# EAGLE design ciborg-3 (EAGLE 5.11)
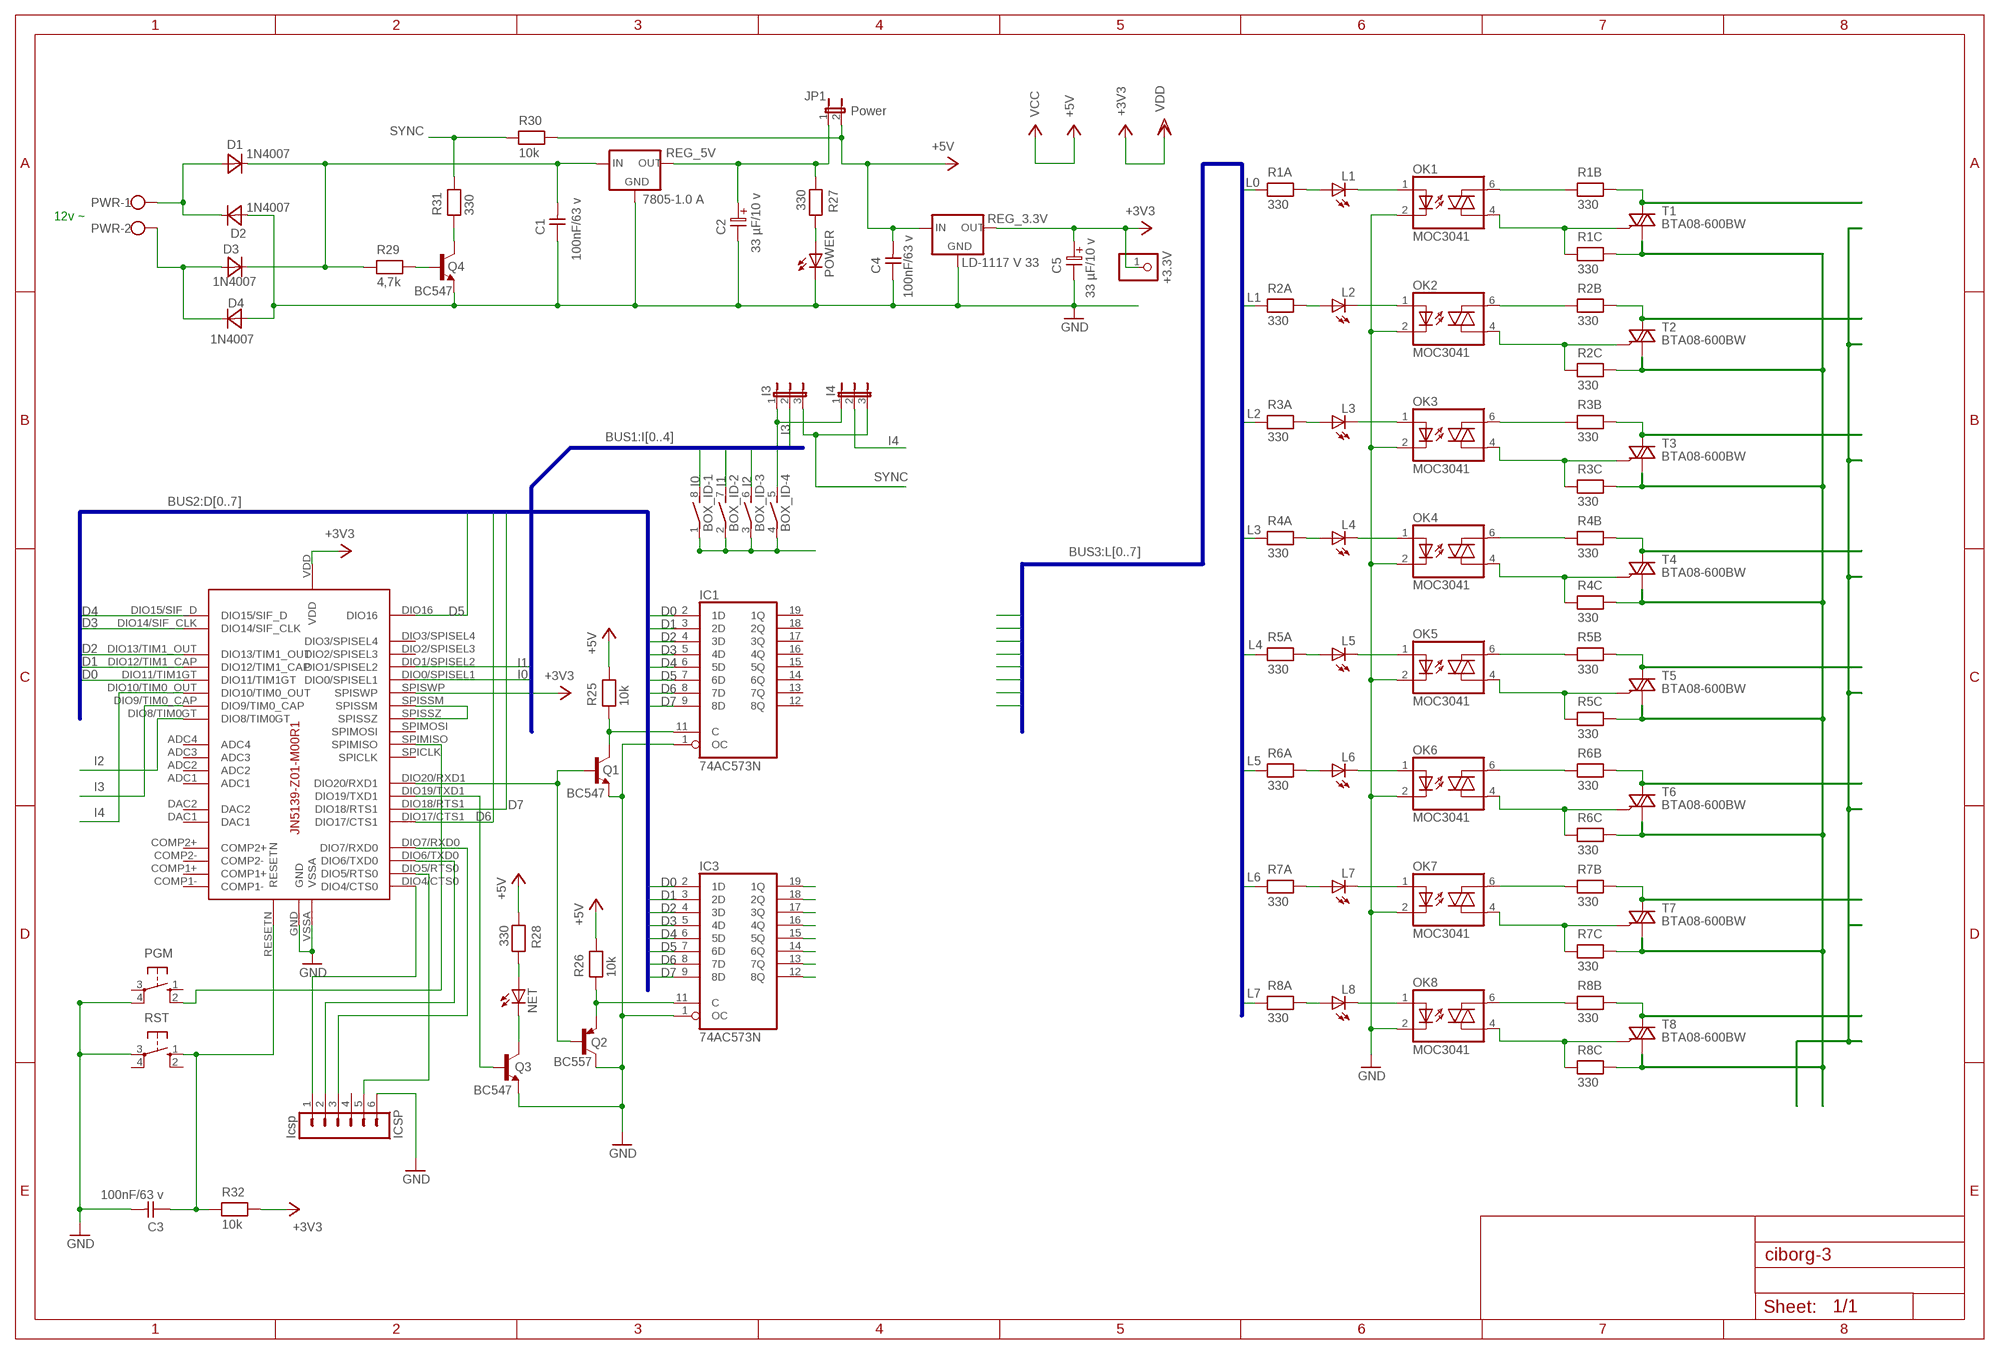
[diagram p0: schematic, sheet 1]

## Parts
+3.3V  PINHD-1X1  [1X01]
BOX_ID  DIP04S  [DIP04S]
C1  100nF/63 v  CAPNP-5  [C-5]
C2  33 µF/10 v  ELC-2,5L  [ES-2,5L]
C3  100nF/63 v  CAPNP-5  [C-5]
C4  100nF/63 v  CAPNP-5  [C-5]
C5  33 µF/10 v  ELC-2,5L  [ES-2,5L]
D1  1N4007  DIODE-10  [D-10]
D2  1N4007  DIODE-10  [D-10]
D3  1N4007  DIODE-10  [D-10]
D4  1N4007  DIODE-10  [D-10]
I3  JP2E  [JP2]
I4  JP2E  [JP2]
IC1  74AC573N  [DIL20]
IC3  74AC573N  [DIL20]
ICSP  Icsp  MA06-1  [MA06-1]
JP1  Power  JP1E  [JP1]
L1  LED3MM  [LED3MM]
L2  LED3MM  [LED3MM]
L3  LED3MM  [LED3MM]
L4  LED3MM  [LED3MM]
L5  LED3MM  [LED3MM]
L6  LED3MM  [LED3MM]
L7  LED3MM  [LED3MM]
L8  LED3MM  [LED3MM]
NET  LED3MM  [LED3MM]
OK1  MOC3041  IL420  [DIL06]
OK2  MOC3041  IL420  [DIL06]
OK3  MOC3041  IL420  [DIL06]
OK4  MOC3041  IL420  [DIL06]
OK5  MOC3041  IL420  [DIL06]
OK6  MOC3041  IL420  [DIL06]
OK7  MOC3041  IL420  [DIL06]
OK8  MOC3041  IL420  [DIL06]
PGM  10-XX  [B3F-10XX]
POWER  LED3MM  [LED3MM]
PWR  AK550/2  [AK550/2]
Q1  BC547  [TO92]
Q2  BC557  [TO92]
Q3  BC547  [TO92]
Q4  BC547  [TO92]
R1A  330  RESEU-7,5  [R-7,5]
R1B  330  RESEU-7,5  [R-7,5]
R1C  330  RESEU-7,5  [R-7,5]
R2A  330  RESEU-7,5  [R-7,5]
R2B  330  RESEU-7,5  [R-7,5]
R2C  330  RESEU-7,5  [R-7,5]
R3A  330  RESEU-7,5  [R-7,5]
R3B  330  RESEU-7,5  [R-7,5]
R3C  330  RESEU-7,5  [R-7,5]
R4A  330  RESEU-7,5  [R-7,5]
R4B  330  RESEU-7,5  [R-7,5]
R4C  330  RESEU-7,5  [R-7,5]
R5A  330  RESEU-7,5  [R-7,5]
R5B  330  RESEU-7,5  [R-7,5]
R5C  330  RESEU-7,5  [R-7,5]
R6A  330  RESEU-7,5  [R-7,5]
R6B  330  RESEU-7,5  [R-7,5]
R6C  330  RESEU-7,5  [R-7,5]
R7A  330  RESEU-7,5  [R-7,5]
R7B  330  RESEU-7,5  [R-7,5]
R7C  330  RESEU-7,5  [R-7,5]
R8A  330  RESEU-7,5  [R-7,5]
R8B  330  RESEU-7,5  [R-7,5]
R8C  330  RESEU-7,5  [R-7,5]
R25  10k  RESEU-7,5  [R-7,5]
R26  10k  RESEU-7,5  [R-7,5]
R27  330  RESEU-7,5  [R-7,5]
R28  330  RESEU-7,5  [R-7,5]
R29  4,7k  RESEU-7,5  [R-7,5]
R30  10k  RESEU-7,5  [R-7,5]
R31  330  RESEU-7,5  [R-7,5]
R32  10k  RESEU-7,5  [R-7,5]
REG_3.3V  LD-1117 V 33  78XXS  [78XXS]
REG_5V  7805-1.0 A  78XXS  [78XXS]
RST  10-XX  [B3F-10XX]
T1  BTA08-600BW  TIC225S  [TO220DS]
T2  BTA08-600BW  TIC225S  [TO220DS]
T3  BTA08-600BW  TIC225S  [TO220DS]
T4  BTA08-600BW  TIC225S  [TO220DS]
T5  BTA08-600BW  TIC225S  [TO220DS]
T6  BTA08-600BW  TIC225S  [TO220DS]
T7  BTA08-600BW  TIC225S  [TO220DS]
T8  BTA08-600BW  TIC225S  [TO220DS]
U1  JN5139-Z01-M00R1  [JENNIC5139MODULE]

## Nets
D0: IC1.2(1D) IC3.2(1D) U1.DIO11/TIM1GT
D1: IC1.3(2D) IC3.3(2D) U1.DIO12/TIM1_CAP
D2: IC1.4(3D) IC3.4(3D) U1.DIO13/TIM1_OUT
D3: IC1.5(4D) IC3.5(4D) U1.DIO14/SIF_CLK
D4: IC1.6(5D) IC3.6(5D) U1.DIO15/SIF_D
D5: IC1.7(6D) IC3.7(6D) U1.DIO16
D6: IC1.8(7D) IC3.8(7D) U1.DIO17/CTS1
D7: IC1.9(8D) IC3.9(8D) U1.DIO18/RTS1
GND: C1.1 C2.2 C3.2 C4.1 C5.2 D2.1(A) D4.1(A) IC1.1(OC) IC3.1(OC) ICSP.6 OK1.2(C) OK2.2(C) OK3.2(C) OK4.2(C) OK5.2(C) OK6.2(C) OK7.2(C) OK8.2(C) PGM.4(P1) POWER.K(C) Q1.1(E) Q2.3(C) Q3.1(E) Q4.1(E) REG_3.3V.GND REG_5V.GND RST.3(P) U1.GND U1.VSSA
I0: BOX_ID.8 U1.DIO0/SPISEL1
I1: BOX_ID.7 U1.DIO1/SPISEL2
I2: BOX_ID.6 U1.DIO8/TIM0GT
I3: I3.2 U1.DIO9/TIM0_CAP
I4: I4.2 U1.DIO10/TIM0_OUT
L0: R1A.1
L1: R2A.1
L2: R3A.1
L3: R4A.1
L4: R5A.1
L5: R6A.1
L6: R7A.1
L7: R8A.1
N$1: L4.K(C) OK4.1(A)
N$2: C2.1 JP1.1 R27.1 REG_5V.OUT
N$3: BOX_ID.1 BOX_ID.2 BOX_ID.3 BOX_ID.4
N$6: OK2.4(A1) R2C.1 T2.G
N$7: C3.1 R32.1 RST.1(S) U1.RESETN
N$8: OK1.4(A1) R1C.1 T1.G
N$10: OK3.4(A1) R3C.1 T3.G
N$12: OK4.4(A1) R4C.1 T4.G
N$13: L1.K(C) OK1.1(A)
N$15: OK5.4(A1) R5C.1 T5.G
N$17: L2.K(C) OK2.1(A)
N$18: OK6.4(A1) R6C.1 T6.G
N$19: L3.K(C) OK3.1(A)
N$21: OK7.4(A1) R7C.1 T7.G
N$22: L5.K(C) OK5.1(A)
N$24: OK8.4(A1) R8C.1 T8.G
N$25: OK1.6(A2) R1B.1
N$26: OK2.6(A2) R2B.1
N$27: L6.K(C) OK6.1(A)
N$29: C1.2 D1.2(K) D3.2(K) R29.1 REG_5V.IN
N$30: OK3.6(A2) R3B.1
N$31: OK4.6(A2) R4B.1
N$32: L7.K(C) OK7.1(A)
N$33: OK5.6(A2) R5B.1
N$34: OK6.6(A2) R6B.1
N$35: OK7.6(A2) R7B.1
N$36: OK8.6(A2) R8B.1
N$37: L8.K(C) OK8.1(A)
N$38: NET.K(C) Q3.3(C)
N$45: IC3.19(1Q)
N$46: IC3.18(2Q)
N$47: IC3.17(3Q)
N$48: IC3.16(4Q)
N$49: IC3.15(5Q)
N$50: IC3.14(6Q)
N$51: IC3.13(7Q)
N$52: IC3.12(8Q)
N$53: L2.A R2A.2
N$54: L3.A R3A.2
N$55: L4.A R4A.2
N$56: L5.A R5A.2
N$57: L6.A R6A.2
N$58: L7.A R7A.2
N$59: L8.A R8A.2
N$60: L1.A R1A.2
N$61: IC1.11(C) Q1.3(C) R25.1
N$62: NET.A R28.2
N$63: IC3.11(C) Q2.1(E) R26.1
N$64: Q1.2(B) Q2.2(B) U1.DIO20/RXD1
N$65: POWER.A R27.2
N$66: BOX_ID.5 I3.1 I4.1
N$67: ICSP.2 U1.DIO6/TXD0
N$68: D1.1(A) D2.2(K) PWR.1
N$69: D3.1(A) D4.2(K) PWR.2
N$70: PGM.2(S1) U1.SPIMISO
N$71: Q4.2(B) R29.2
N$72: Q4.3(C) R31.1
N$73: ICSP.1 U1.DIO4/CTS0
N$74: ICSP.5 U1.DIO5/RTS0
N$75: Q3.2(B) U1.DIO19/TXD1
N$76: U1.SPISSM U1.SPISSZ
N$77: ICSP.3 U1.DIO7/RXD0
N$78 [AC_VOLTAGE]: R1B.2 T1.A2
N$79 [AC_VOLTAGE]: R2B.2 T2.A2
N$80 [AC_VOLTAGE]: R3B.2 T3.A2
N$81 [AC_VOLTAGE]: R4B.2 T4.A2
N$82 [AC_VOLTAGE]: R5B.2 T5.A2
N$83 [AC_VOLTAGE]: R6B.2 T6.A2
N$84 [AC_VOLTAGE]: R7B.2 T7.A2
NEUTRE [AC_VOLTAGE]: R1C.2 R2C.2 R3C.2 R4C.2 R5C.2 R6C.2 R7C.2 R8C.2 T1.A1 T2.A1 T3.A1 T4.A1 T5.A1 T6.A1 T7.A1 T8.A1
PHASE [AC_VOLTAGE]: R8B.2 T8.A2
SYNC: I3.3 I4.3 R30.1 R31.2
VCC: C4.2 JP1.2 R25.2 R26.2 R28.1 R30.2 REG_3.3V.IN ; supply symbol labelled +5V
VDD: +3.3V.1 C5.1 R32.2 REG_3.3V.OUT U1.SPISWP U1.VDD ; supply symbol labelled +3V3
Unconnected: IC1.12(8Q) IC1.13(7Q) IC1.14(6Q) IC1.15(5Q) IC1.16(4Q) IC1.17(3Q) IC1.18(2Q) IC1.19(1Q) ICSP.4 PGM.1(S) PGM.3(P) RST.2(S1) RST.4(P1) U1.ADC1 U1.ADC2 U1.ADC3 U1.ADC4 U1.COMP1+ U1.COMP1- U1.COMP2+ U1.COMP2- U1.DAC1 U1.DAC2 U1.DIO2/SPISEL3 U1.DIO3/SPISEL4 U1.SPICLK U1.SPIMOSI

## Buses
BUS3:L[0..7]
BUS2:D[0..7]
BUS1:I[0..4]

## Notes on the sheet
- 12v ~

## Power pins joined to a net without a drawn wire
GND: IC1.10(GND) IC3.10(GND)
VCC: IC1.20(VCC) IC3.20(VCC)

## Library data of the parts
+3.3V = pinhead:PINHD-1X1: PIN HEADER
BOX_ID = switch-dil:DIP04S: DIL/CODE SWITCH; OC_FARNELL: unknown; OC_NEWARK: unknown
C1 C3 C4 = discrete:CAPNP-5
C2 C5 = discrete:ELC-2,5L
D1-D4 = discrete:DIODE-10
I3 I4 = jumper:JP2E: JUMPER
IC1 IC3 = 74xx-eu:74*573: 8-bit D latch BUS DRIVER
ICSP = con-lstb:MA06-1: PIN HEADER; OC_FARNELL: unknown; OC_NEWARK: unknown
JP1 = jumper:JP1E: JUMPER
L1-L8 NET POWER = led:LED: LED OSRAM: - CHIPLED LG R971, LG N971, LY N971, LG Q971, LY Q971, LO R971, LY R971 LH N974, LH R974 LS Q976, LO Q976, LY Q976 LO Q996 - Hyper CHIPLED LW Q18S LB Q993, LB Q99A, LB R99A - SideLED LS A670, LO A670, LY A670, LG A670, LP A670 LB A673, LV A673, LT A673, LW A673 LH A674 LY A675 LS A676, LA A676, LO A676, LY A676, LW A676 LS A679, LY A679, LG A679 - Hyper Micro SIDELED® LS Y876, LA Y876, LO Y876, LY Y876 LT Y87S - SmartLED LW L88C, LW L88S LB L89C, LB L89S, LG L890 LS L89K, LO L89K, LY L89K LS L896, LA L896, LO L896, LY L896 - TOPLED LS T670, LO T670, LY T670, LG T670, LP T670 LSG T670, LSP T670, LSY T670, LOP T670, LYG T670 LG T671, LOG T671, LSG T671 LB T673, LV T673, LT T673, LW T673 LH T674 LS T676, LA T676, LO T676, LY T676, LB T676, LH T676, LSB T676, LW T676 LB T67C, LV T67C, LT T67C, LS T67K, LO T67K, LY T67K, LW E67C LS E67B, LA E67B, LO E67B, LY E67B, LB E67C, LV E67C, LT E67C LW T67C LS T679, LY T679, LG T679 LS T770, LO T770, LY T770, LG T770, LP T770 LB T773, LV T773, LT T773, LW T773 LH T774 LS E675, LA E675, LY E675, LS T675 LS T776, LA T776, LO T776, LY T776, LB T776 LHGB T686 LT T68C, LB T68C - Hyper Mini TOPLED® LB M676 - Mini TOPLED Santana® LG M470 LS M47K, LO M47K, LY M47K Source: http://www.osram.convergy.de LUXEON: - LUMILED® LXK2-PW12-R00, LXK2-PW12-S00, LXK2-PW14-U00, LXK2-PW14-V00 LXK2-PM12-R00, LXK2-PM12-S00, LXK2-PM14-U00 LXK2-PE12-Q00, LXK2-PE12-R00, LXK2-PE12-S00, LXK2-PE14-T00, LXK2-PE14-U00 LXK2-PB12-K00, LXK2-PB12-L00, LXK2-PB12-M00, LXK2-PB14-N00, LXK2-PB14-P00, LXK2-PB14-Q00 LXK2-PR12-L00, LXK2-PR12-M00, LXK2-PR14-Q00, LXK2-PR14-R00 LXK2-PD12-Q00, LXK2-PD12-R00, LXK2-PD12-S00 LXK2-PH12-R00, LXK2-PH12-S00 LXK2-PL12-P00, LXK2-PL12-Q00, LXK2-PL12-R00 Source: www.luxeon.com KINGBRIGHT: KA-3528ASYC Source: www.kingbright.com
OK1-OK8 = optocoupler:IL420: SIEMENS OPTO COUPLER
PGM RST = switch-omron:10-XX: OMRON SWITCH; MPN: B3F-1000; OC_FARNELL: 176432; OC_NEWARK: 36M3542
PWR = con-ptr500+:AK550/2: CONNECTOR
Q1 Q3 Q4 = transistor:BC547: NPN TRANSISTOR
Q2 = transistor-pnp:BC557: PNP Transistor
R1A R1B R1C R2A R2B R2C R3A R3B R3C R4A R4B R4C R5A R5B R5C R6A R6B R6C R7A R7B R7C R8A R8B R8C R25-R32 = discrete:RESEU-7,5
REG_3.3V REG_5V = v-reg:78XXS: VOLTAGE REGULATOR
T1-T8 = triac:TIC225S: TRIAC
U1 = jennic:JN5139-Z01-M00R1: Jennic 5139 Zigbee Module

## Net classes
0 default: width 0.254 mm, clearance 0.254 mm
1 AC_VOLTAGE: width 1.5 mm, clearance 0.254 mm
2 AC_TERRE: width 1.422 mm, clearance 0.254 mm

## Board
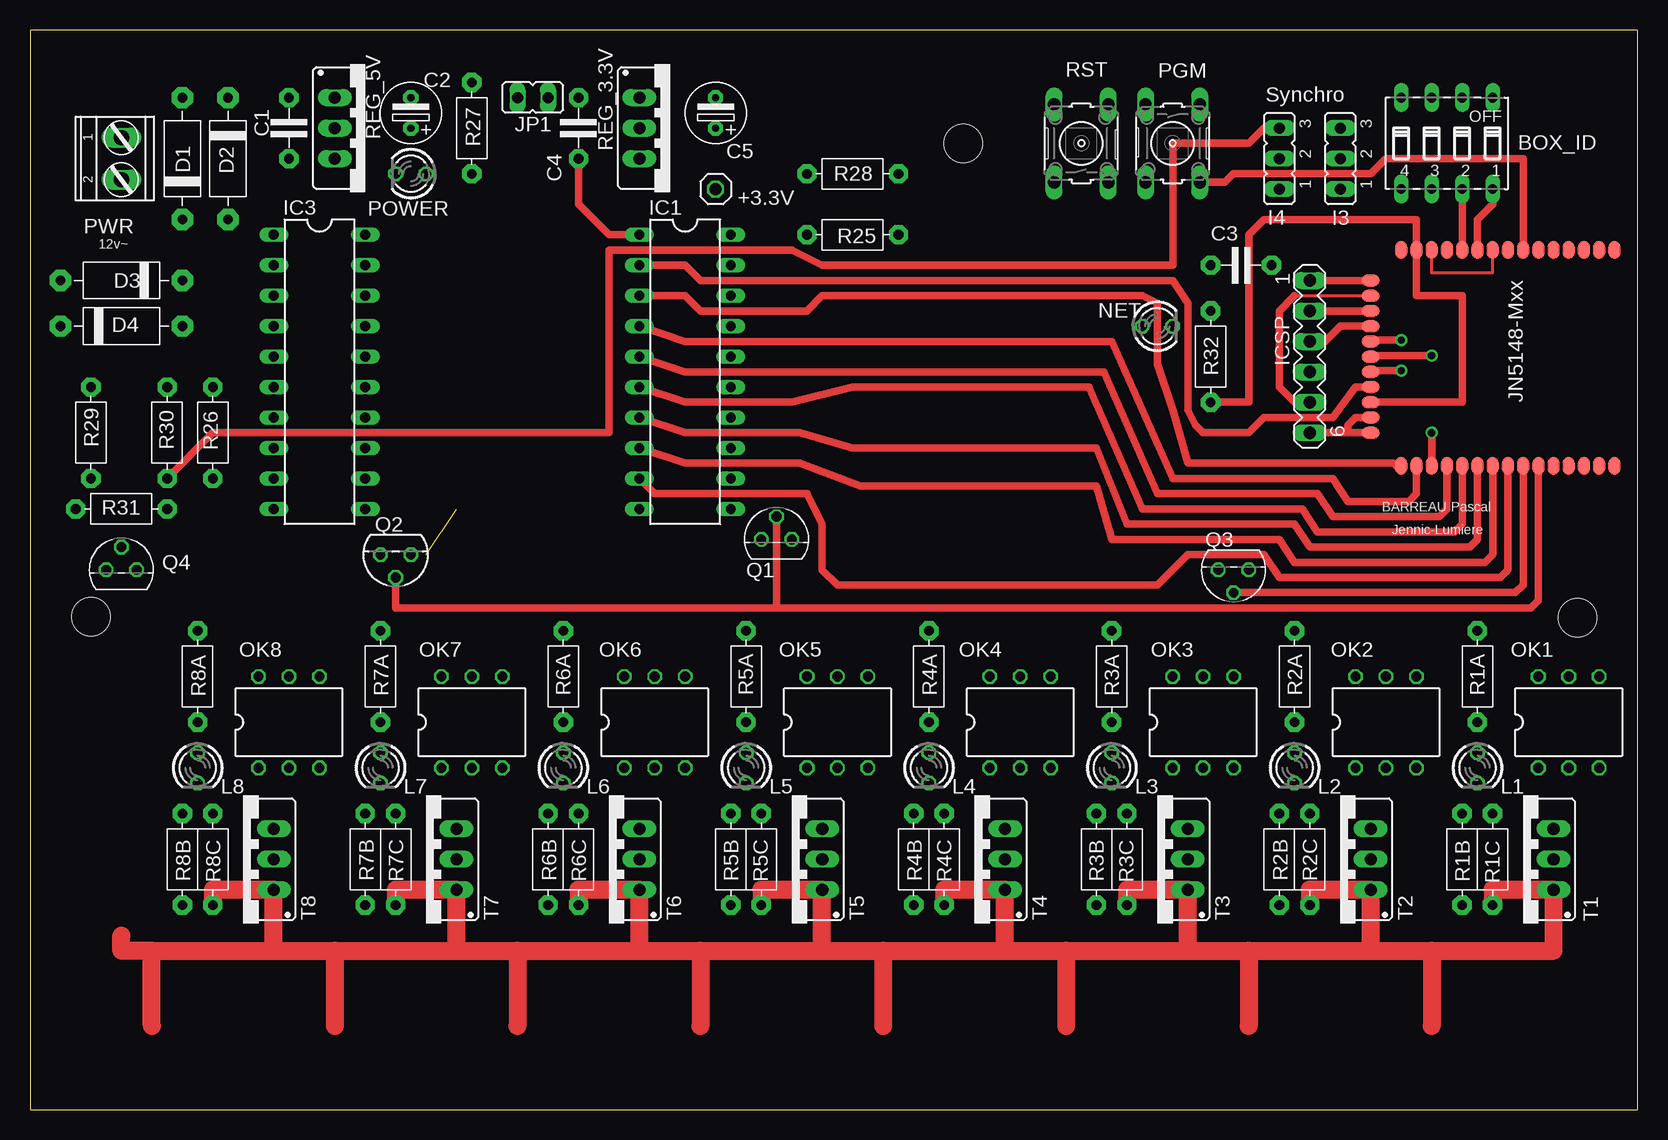
[diagram p1: board, top side]
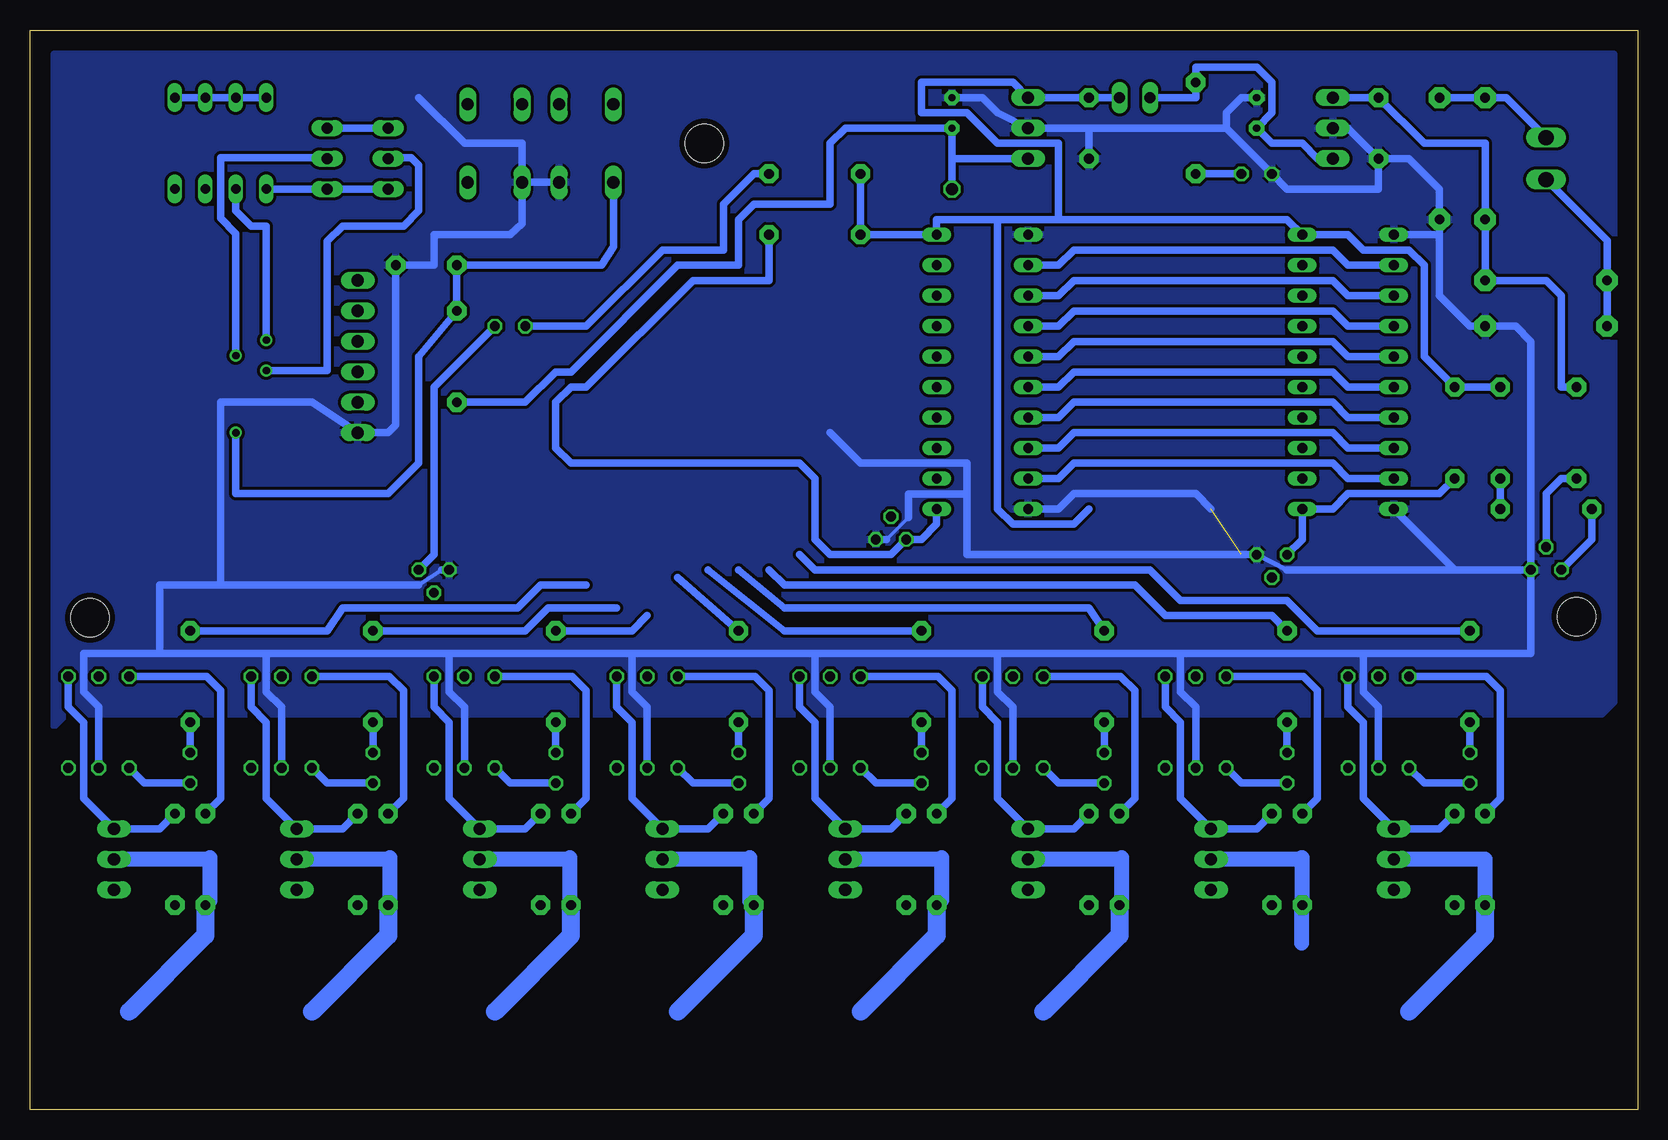
[diagram p2: board, bottom side, seen from below]

Size 134 x 90 mm. Coordinates in mm from the lower left corner, seen from the top.
Outline: 0,0 134,0 134,90 0,90 0,0
Copper layers (1*16): Top 0.018mm / dielectric 1.55mm / Bottom 0.018mm
Design rules "eC-PCB_proto-2-layer": minimum track width 0.15mm, minimum drill 0.25mm, track to track 0.15mm, track to pad 0.15mm, pad to pad 0.15mm, via to via 0.15mm, smd to smd 0.15mm, copper to edge 0.45mm, drill to drill 0.3mm, minimum pad ring 0.2mm, minimum via ring 0.2mm, stop-mask expansion 0.1mm, vias tented up to drill 0mil, thermal gap 0.2mm
Holes 3.2 mm at 129,41 77.8,80.55 5.08,41.1

### Footprints (pad centres in the part's own frame; a part is rotated, then mirrored left to right if it is on the bottom)
1X01 = drill 1.016 octagon: 1 0,0
DIP04S = drill 0.813 long: 1 -3.81,-3.81; 2 -1.27,-3.81; 3 1.27,-3.81; 4 3.81,-3.81; 5 3.81,3.81; 6 1.27,3.81; 7 -1.27,3.81; 8 -3.81,3.81
C-5 = drill 0.813 pad 1.6 octagon: 1 -2.54,0; 2 2.54,0
ES-2,5L = drill 0.61 pad 1.27 octagon: 1 0,0; 2 2.54,0
D-10 = drill 0.813 pad 1.778 octagon: 1 -5.08,0; 2 5.08,0
JP2 = drill 0.914 long: 1 -2.54,0; 2 0,0; 3 2.54,0
DIL20 = drill 0.813 long: 1 -11.43,-3.81; 2 -8.89,-3.81; 3 -6.35,-3.81; 4 -3.81,-3.81; 5 -1.27,-3.81; 6 1.27,-3.81; 7 3.81,-3.81; 8 6.35,-3.81; 9 8.89,-3.81; 10 11.43,-3.81; 11 11.43,3.81; 12 8.89,3.81; 13 6.35,3.81; 14 3.81,3.81; 15 1.27,3.81; 16 -1.27,3.81; 17 -3.81,3.81; 18 -6.35,3.81; 19 -8.89,3.81; 20 -11.43,3.81
MA06-1 = drill 1.016 long: 1 -6.35,0; 2 -3.81,0; 3 -1.27,0; 4 1.27,0; 5 3.81,0; 6 6.35,0
JP1 = drill 0.914 long: 1 0,-1.27; 2 0,1.27
LED3MM = drill 0.813 octagon: A -1.27,0; K 1.27,0
DIL06 = drill 0.813 octagon: 1 -2.54,-3.81; 2 0,-3.81; 3 2.54,-3.81; 4 2.54,3.81; 5 0,3.81; 6 -2.54,3.81
B3F-10XX = drill 1.016 long: 1 -3.251,2.261; 2 3.251,2.261; 3 -3.251,-2.261; 4 3.251,-2.261
AK550/2 = drill 1.27 long: 1 -1.75,0; 2 1.75,0
TO92 = drill 0.813 octagon: 1 1.27,0; 2 0,1.905; 3 -1.27,0
R-7,5 = drill 0.813 pad 1.6 octagon: 1 -3.81,0; 2 3.81,0
78XXS = drill 1.016 long: GND 0,-2.54; IN -2.54,-2.54; OUT 2.54,-2.54
TO220DS = drill 1.016 long: A1 -2.54,-2.54; A2 0,-2.54; G 2.54,-2.54
JENNIC5139MODULE = smd 1.5 x 1: ADC1 18,17.78; ADC2 18,19.05; ADC3 18,20.32; ADC4 0,20.32; COMP1+ 18,16.51; COMP1- 18,15.24; COMP2+ 0,16.51; COMP2- 0,15.24; DAC1 0,19.05; DAC2 0,17.78; DIO0/SPISEL1 0,8.89; DIO1/SPISEL2 0,7.62; DIO2/SPISEL3 0,6.35; DIO3/SPISEL4 0,2.54; DIO12/TIM1_CAP 18,2.54; DIO13/TIM1_OUT 18,3.81; DIO14/SIF_CLK 18,6.35; DIO15/SIF_D 18,7.62; DIO16 18,8.89; DIO17/CTS1 18,10.16; DIO18/RTS1 18,11.43; DIO19/TXD1 18,12.7; DIO20/RXD1 18,13.97; RESETN 18,5.08; SPICLK 0,13.97; SPIMISO 0,12.7; SPIMOSI 0,11.43; SPISSM 0,5.08; SPISSZ 0,10.16; SPISWP 0,3.81 | smd 1 x 1.5: DIO4/CTS0 2.54,0; DIO5/RTS0 3.81,0; DIO6/TXD0 5.08,0; DIO7/RXD0 6.35,0; DIO8/TIM0GT 7.62,0; DIO9/TIM0_CAP 8.89,0; DIO10/TIM0_OUT 10.16,0; DIO11/TIM1GT 11.43,0; GND 13.97,0; VDD 12.7,0; VSSA 15.24,0

### Placement (x,y rotation side)
+3.3V  57.15,76.74 0 top
BOX_ID  118.11,80.55 180 top
C1  21.59,81.82 90 top
C2  31.75,81.82 90 top
C3  100.97,70.39 0 top
C4  45.72,81.82 90 top
C5  57.15,81.82 90 top
D1  12.7,79.28 270 top
D2  16.51,79.28 90 top
D3  7.62,69.12 0 top
D4  7.62,65.31 180 top
I3  109.22,79.28 90 top
I4  104.14,79.28 90 top
IC1  54.61,61.5 270 top
IC3  24.13,61.5 270 top
ICSP  106.68,62.77 270 top
JP1  41.91,84.36 270 top
L1  120.65,28.48 270 top
L2  105.41,28.48 270 top
L3  90.17,28.48 270 top
L4  74.93,28.48 270 top
L5  59.69,28.48 270 top
L6  44.45,28.48 270 top
L7  29.21,28.48 270 top
L8  13.97,28.48 270 top
NET  93.98,65.31 0 top
OK1  128.27,32.29 0 top
OK2  113.03,32.29 0 top
OK3  97.79,32.29 0 top
OK4  82.55,32.29 0 top
OK5  67.31,32.29 0 top
OK6  52.07,32.29 0 top
OK7  36.83,32.29 0 top
OK8  21.59,32.29 0 top
PGM  95.25,80.55 270 top
POWER  31.75,78.01 180 top
PWR  7.62,79.28 270 top
Q1  62.23,47.53 0 top
Q2  30.48,46.26 180 top
Q3  100.33,44.99 180 top
Q4  7.62,44.99 0 top
R1A  120.65,36.1 270 top
R1B  119.38,20.86 270 top
R1C  121.92,20.86 270 top
R2A  105.41,36.1 270 top
R2B  104.14,20.86 270 top
R2C  106.68,20.86 270 top
R3A  90.17,36.1 270 top
R3B  88.9,20.86 270 top
R3C  91.44,20.86 270 top
R4A  74.93,36.1 270 top
R4B  73.66,20.86 270 top
R4C  76.2,20.86 270 top
R5A  59.69,36.1 270 top
R5B  58.42,20.86 270 top
R5C  60.96,20.86 270 top
R6A  44.45,36.1 270 top
R6B  43.18,20.86 270 top
R6C  45.72,20.86 270 top
R7A  29.21,36.1 270 top
R7B  27.94,20.86 270 top
R7C  30.48,20.86 270 top
R8A  13.97,36.1 270 top
R8B  12.7,20.86 270 top
R8C  15.24,20.86 270 top
R25  68.58,72.93 180 top
R26  15.24,56.42 90 top
R27  36.83,81.82 270 top
R28  68.58,78.01 0 top
R29  5.08,56.42 270 top
R30  11.43,56.42 90 top
R31  7.62,50.07 0 top
R32  98.42,62.77 270 top
REG_3.3V  53.34,81.82 270 top
REG_5V  27.94,81.82 270 top
RST  87.63,80.55 90 top
T1  124.46,20.86 90 top
T2  109.22,20.86 90 top
T3  93.98,20.86 90 top
T4  78.74,20.86 90 top
T5  63.5,20.86 90 top
T6  48.26,20.86 90 top
T7  33.02,20.86 90 top
T8  17.78,20.86 90 top
U1  111.76,71.66 270 top

### Tracks (layer width: path | path; a pad name or v marks a point on that pad's centre or on a via)
D0
  Top 0.61: IC1.2 54.61,70.39 55.88,69.12 95.25,69.12 96.52,67.22 96.52,58.33 97.16,57.05 97.79,56.42 101.6,56.42 102.87,57.69 108.58,57.69 110.49,60.23 U1.DIO11/TIM1GT
  Bottom 0.61: IC3.2 24.13,70.39 25.4,71.66 46.99,71.66 48.26,70.39 IC1.2
D1
  Top 0.61: IC1.3 54.61,67.85 55.88,66.58 64.77,66.58 66.04,67.85 92.71,67.85 93.98,67.22 93.98,62.13 95.25,58.33 96.52,53.88 113.67,53.88 113.89,53.66 U1.DIO12/TIM1_CAP
  Bottom 0.61: IC3.3 24.13,67.85 25.4,69.12 46.99,69.12 48.26,67.85 IC1.3
D2
  Top 0.254: U1.DIO13/TIM1_OUT 115.57,53.88
  Top 0.61: IC1.4 54.61,64.04 90.17,64.04 95.25,52.61 108.58,52.61 109.86,50.7 114.94,50.7 115.57,51.34 U1.DIO13/TIM1_OUT
  Bottom 0.61: IC3.4 24.13,65.31 25.4,66.58 46.99,66.58 48.26,65.31 IC1.4
D3
  Top 0.61: IC1.5 54.61,61.5 89.53,61.5 93.98,51.34 107.31,51.34 108.58,49.44 117.47,49.44 118.11,50.07 U1.DIO14/SIF_CLK
  Bottom 0.61: IC3.5 24.13,62.77 25.4,64.04 46.99,64.04 48.26,62.77 IC1.5
D4
  Top 0.61: IC1.6 54.61,58.96 63.5,58.96 68.58,60.23 88.27,60.23 92.71,50.07 106.05,50.07 107.31,48.16 118.75,48.16 119.38,48.8 U1.DIO15/SIF_D
  Bottom 0.61: IC3.6 24.13,60.23 25.4,61.5 46.99,61.5 48.26,60.23 IC1.6
D5
  Top 0.61: IC1.7 54.61,56.42 64.14,56.42 68.58,55.15 88.9,55.15 91.44,48.8 105.41,48.8 106.68,46.9 120.02,46.9 120.65,47.53 U1.DIO16
  Bottom 0.61: IC3.7 24.13,57.69 25.4,58.96 46.99,58.96 48.26,57.69 IC1.7
D6
  Top 0.61: IC1.8 54.61,53.88 64.14,53.88 69.22,51.98 88.9,51.98 90.17,47.53 104.14,47.53 105.41,45.62 121.28,45.62 121.92,46.26 U1.DIO17/CTS1
  Bottom 0.61: IC3.8 24.13,55.15 25.4,56.42 46.99,56.42 48.26,55.15 IC1.8
D7
  Top 0.254: U1.DIO18/RTS1 123.19,53.88
  Top 0.61: U1.DIO18/RTS1 123.19,44.99 122.56,44.35 104.14,44.35 102.87,46.26 96.52,46.26 93.98,43.72 67.31,43.72 66.04,44.99 66.04,48.8 64.77,51.34 52.07,51.34 IC1.9
  Bottom 0.61: IC3.9 24.13,52.61 25.4,53.88 46.99,53.88 48.26,52.61 IC1.9
GND  (1 unrouted)
  Top 0.61: ICSP.6 109.86,56.42 | 109.86,56.42 U1.VSSA | C4.1 45.72,75.47 48.26,72.93 IC1.1 | U1.GND 110.49,57.69 109.86,57.05 109.86,56.42
  Bottom 0.305: 60.76,49.37 62.6,47.53 | 55.91,51.31 55.88,51.34 | 101.6,43.72 99.69,44.99
  Bottom 0.406: 29.21,44.99 Q2.3
  Bottom 0.61: REG_3.3V.GND 49.53,81.82 | REG_3.3V.GND 53.34,83.09 54.61,84.36 C5.2 | C1.1 24.13,81.82 REG_5V.GND | C1.1 19.05,79.28 16.51,76.74 D2.1 16.51,72.93 | C2.2 33.02,84.36 34.29,83.09 34.29,81.82 | 34.29,81.82 POWER.K 29.21,76.74 21.59,76.74 C1.1 | 34.29,81.82 45.72,81.82 | 45.72,81.82 REG_3.3V.GND | 45.72,81.82 C4.1 | IC1.10 48.26,50.07 46.99,51.34 36.83,51.34 35.56,50.07 | 16.51,72.93 16.51,67.85 13.97,65.31 D4.1 10.16,65.31 8.89,64.04 Q4.1 | 16.51,72.93 IC3.1 | 15.24,44.99 IC3.10 | Q4.1 15.24,44.99 | 15.24,44.99 29.21,44.99 | Q2.3 33.02,46.26 44.45,46.26 55.88,46.26 55.88,51.29 55.91,51.31 60.76,51.31 60.76,49.37 | 55.88,51.34 55.88,53.88 64.77,53.88 67.31,56.42 | 62.6,47.53 Q1.1 | PGM.4 RST.3 | PGM.4 92.99,73.84 93.98,72.93 100.33,72.93 100.33,70.39 C3.2 103.5,57.05 104.14,56.42 ICSP.6 110.49,58.96 118.11,58.96 118.11,43.72 | 101.6,84.36 97.79,80.55 92.98,80.55 92.98,78.29 PGM.4 | 99.69,44.99 Q3.1 | 118.11,43.72 101.6,43.72 | OK8.2 21.59,33.56 22.86,34.83 22.86,38.01 | 114.3,38.01 114.3,34.83 113.03,33.56 OK2.2 | 118.11,43.72 123.19,43.72 123.19,38.01 | 114.3,38.01 123.19,38.01 | 22.86,38.01 38.1,38.01 | 38.1,38.01 53.34,38.01 | 53.34,38.01 68.58,38.01 | 68.58,38.01 83.82,38.01 | 83.82,38.01 99.06,38.01 | 99.06,38.01 114.3,38.01 | OK7.2 36.83,33.56 38.1,34.83 38.1,38.01 | OK6.2 52.07,33.56 53.34,34.83 53.34,38.01 | OK5.2 67.31,33.56 68.58,34.83 68.58,38.01 | OK4.2 82.55,33.56 83.82,34.83 83.82,38.01 | OK3.2 97.79,33.56 99.06,34.83 99.06,38.01 | OK1.2 128.27,33.56 129.54,34.83 129.54,38.01 123.19,38.01 | 22.86,38.01 8.89,38.01 Q4.1
  pour Bottom: 2,88 132,88 132,32 131,33 3,33 2,34
I0
  Top 0.61: U1.DIO0/SPISEL1 120.65,74.2 121.92,75.47 BOX_ID.8
I1
  Top 0.61: U1.DIO1/SPISEL2 BOX_ID.7
I2  (via drill 0.6)
  Top 0.61: U1.DIO8/TIM0GT 111.86,64.14 v114.3,64.14
  Bottom 0.61: BOX_ID.6 116.84,74.93 115.57,73.66 114.3,73.66 v114.3,64.14
I3  (via drill 0.6)
  Top 0.61: U1.DIO9/TIM0_CAP 111.86,62.87 v116.84,62.87
  Bottom 0.61: I3.2 109.31,79.38 118.11,79.38 118.11,74.3 116.84,73.03 v116.84,62.87
I4  (via drill 0.6)
  Top 0.61: U1.DIO10/TIM0_OUT 111.86,61.59 v114.3,61.59
  Bottom 0.61: I4.2 104.05,79.38 102.23,79.38 101.6,78.74 101.6,74.93 102.87,73.66 107.95,73.66 109.22,72.39 109.22,61.59 v114.3,61.59
L0
  Bottom 0.61: 87.63,43.72 91.44,43.72 93.34,41.81 107.95,41.81 109.22,39.91 R1A.1
L1
  Bottom 0.61: 85.09,41.81 90.81,41.81 92.71,39.91 R2A.1
L2
  Bottom 0.61: 82.55,41.18 83.82,39.91 R3A.1
L3
  Bottom 0.61: R4A.1 80.01,44.35
L4
  Bottom 0.61: 77.47,44.99 71.12,39.91 R5A.1
L5
  Bottom 0.61: 74.93,44.99 71.12,41.81 45.72,41.81 R6A.1
L6
  Bottom 0.61: R7A.1 30.48,41.18 39.37,41.18 41.91,43.72 71.12,43.72 72.39,44.99
L7
  Bottom 0.61: R8A.1 26.67,39.91 29.21,42.45 38.1,42.45 40.64,44.99 68.58,44.99 69.85,46.26
N$1
  Bottom 0.61: L4.K 78.74,27.21 OK4.1
N$2
  Bottom 0.61: REG_5V.OUT 26.67,79.28 27.94,80.55 30.48,80.55 C2.1 30.48,83.09 30.48,85.63 31.75,86.9 36.83,86.9 R27.1 36.83,84.36 JP1.1
N$3
  Bottom 0.61: BOX_ID.1 BOX_ID.2 BOX_ID.3 BOX_ID.4
N$6
  Bottom 0.61: R2C.1 107.95,23.4 T2.G 114.3,25.94 114.3,32.29 115.57,33.56 OK2.4
N$7  (via drill 0.6)
  Top 0.61: v116.84,56.42 U1.RESETN
  Bottom 0.61: RST.1 85.37,71.94 86.36,70.39 C3.1 R32.1 101.6,62.77 101.6,53.88 104.14,51.34 116.84,51.34 v116.84,56.42
N$8
  Bottom 0.61: R1C.1 123.19,23.4 T1.G 129.54,25.94 129.54,32.29 130.81,33.56 OK1.4
N$10
  Bottom 0.61: R3C.1 92.71,23.4 T3.G 99.06,25.94 99.06,32.29 100.33,33.56 OK3.4
N$12
  Bottom 0.61: R4C.1 77.47,23.4 T4.G 83.82,25.94 83.82,32.29 85.09,33.56 OK4.4
N$13
  Bottom 0.61: L1.K 124.46,27.21 OK1.1
N$15
  Bottom 0.61: R5C.1 62.23,23.4 T5.G 68.58,25.94 68.58,32.29 69.85,33.56 OK5.4
N$17
  Bottom 0.61: L2.K 109.22,27.21 OK2.1
N$18
  Bottom 0.61: R6C.1 46.99,23.4 T6.G 53.34,25.94 53.34,32.29 54.61,33.56 OK6.4
N$19
  Bottom 0.61: L3.K 93.98,27.21 OK3.1
N$21
  Bottom 0.61: R7C.1 31.75,23.4 T7.G 38.1,25.94 38.1,32.29 39.37,33.56 OK7.4
N$22
  Bottom 0.61: L5.K 63.5,27.21 OK5.1
N$24
  Bottom 0.61: R8C.1 16.51,23.4 T8.G 22.86,25.94 22.86,32.29 24.13,33.56 OK8.4
N$25
  Bottom 0.61: R1B.1 118.11,25.94 118.11,34.92 119.28,36.1 OK1.6
N$26
  Bottom 0.61: R2B.1 102.87,25.94 102.87,34.92 104.05,36.1 OK2.6
N$27
  Bottom 0.61: L6.K 48.26,27.21 OK6.1
N$29
  Bottom 0.61: REG_5V.IN C1.2 17.78,80.55 12.7,80.55 D1.2 D3.2 7.62,69.12 6.35,67.85 6.35,60.23 R29.1
N$30
  Bottom 0.61: R3B.1 87.63,25.94 87.63,34.92 88.81,36.1 OK3.6
N$31
  Bottom 0.61: R4B.1 72.39,25.94 72.39,34.92 73.56,36.1 OK4.6
N$32
  Bottom 0.61: L7.K 33.02,27.21 OK7.1
N$33
  Bottom 0.61: R5B.1 57.15,25.94 57.15,34.92 58.33,36.1 OK5.6
N$34
  Bottom 0.61: R6B.1 41.91,25.94 41.91,34.92 43.09,36.1 OK6.6
N$35
  Bottom 0.61: R7B.1 26.67,25.94 26.67,34.92 27.84,36.1 OK7.6
N$36
  Bottom 0.61: R8B.1 11.43,25.94 11.43,34.92 12.61,36.1 OK8.6
N$37
  Bottom 0.61: L8.K 17.78,27.21 OK8.1
N$38
  Bottom 0.61: NET.K 100.33,60.23 100.33,46.26 Q3.3
N$53
  Bottom 0.61: L2.A R2A.2
N$54
  Bottom 0.61: L3.A R3A.2
N$55
  Bottom 0.61: L4.A R4A.2
N$56
  Bottom 0.61: L5.A R5A.2
N$57
  Bottom 0.61: L6.A R6A.2
N$58
  Bottom 0.61: L7.A R7A.2
N$59
  Bottom 0.61: L8.A R8A.2
N$60
  Bottom 0.61: L1.A R1A.2
N$61
  Bottom 0.61: IC1.11 58.42,48.8 59.69,47.53 Q1.3 62.23,46.26 67.31,46.26 68.58,47.53 68.58,52.61 69.85,53.88 88.9,53.88 90.17,55.15 90.17,58.96 88.9,60.23 87.63,60.23 78.74,69.12 72.39,69.12 R25.1
N$62
  Bottom 0.61: R28.2 73.66,78.01 76.2,75.47 76.2,71.66 81.28,71.66 87.63,65.31 NET.A
N$63
  Bottom 0.61: Q2.1 27.94,47.53 IC3.11 25.4,50.07 24.13,51.34 16.51,51.34 R26.1
N$64
  Top 0.61: 125.73,53.88 U1.DIO20/RXD1 125.73,42.45 125.09,41.81 62.23,41.81 | 62.23,41.81 Q1.2 | Q2.2 30.48,41.81 62.23,41.81
N$65
  Bottom 0.61: POWER.A R27.2
N$66
  Bottom 0.61: I4.1 I3.1 BOX_ID.5
N$67
  Top 0.61: ICSP.2 U1.DIO6/TXD0
N$68
  Bottom 0.61: PWR.1 10.95,84.36 D1.1 D2.2
N$69
  Bottom 0.61: PWR.2 2.54,72.45 D3.1 D4.2
N$70
  Top 0.61: PGM.2 99.62,77.3 100.33,78.01 111.76,78.01 113.03,79.28 124.46,79.28 U1.SPIMISO
N$71
  Bottom 0.61: R29.2 6.35,52.61 7.62,51.34 Q4.2
N$72
  Bottom 0.61: R31.1 3.81,47.53 Q4.3
N$73
  Top 0.61: ICSP.1 U1.DIO4/CTS0
N$74
  Top 0.254: 105.41,67.85 U1.DIO5/RTS0 | 105.41,58.96 ICSP.5
  Top 0.61: 105.41,67.85 104.14,66.58 104.14,60.23 105.41,58.96
N$75
  Top 0.61: U1.DIO19/TXD1 124.46,43.72 123.83,43.09 Q3.2
N$76
  Top 0.254: U1.SPISSM 116.84,69.75 121.92,69.75 U1.SPISSZ
N$77
  Top 0.61: U1.DIO7/RXD0 109.22,65.31 107.95,64.04 ICSP.3
N$78
  Bottom 1.27: T1.A2 119.14,20.86 119,21 119,17.43 R1B.2
  Bottom 1.5: 125.73,8.16 119.38,14.51 R1B.2
N$79
  Bottom 1.27: T2.A2 104.14,20.86 104,21 104,17.19 R2B.2
  Bottom 1.5: 110.49,8.16 104.14,14.51 R2B.2
N$80
  Bottom 1.27: T3.A2 89.14,20.86 89,21 89,17.15 R3B.2
  Bottom 1.5: 95.25,8.16 88.9,14.51 R3B.2
N$81
  Bottom 1.27: T4.A2 74.14,20.86 74,21 74,17.39 R4B.2
  Bottom 1.5: 80.01,8.16 73.66,14.51 R4B.2
N$82
  Bottom 1.27: T5.A2 58.14,20.86 58,21 58,17.47 R5B.2
  Bottom 1.5: 64.77,8.16 58.42,14.51 R5B.2
N$83
  Bottom 1.27: T6.A2 43.14,20.86 43,21 43,17.23 R6B.2
  Bottom 1.5: 49.53,8.16 43.18,14.51 R6B.2
N$84
  Bottom 1.27: T7.A2 28,20.86 28,21 27.94,21 R7B.2 28,17.05 28,13.86
NEUTRE
  Top 1.5: 10.16,13.24 7.62,13.24 7.62,14.51 | 10.16,13.24 20.32,13.24 | 20.32,13.24 25.4,13.24 | 25.4,13.24 35.56,13.24 | 35.56,13.24 40.64,13.24 | 40.64,13.24 50.8,13.24 | 50.8,13.24 55.88,13.24 | 55.88,13.24 66.04,13.24 | 66.04,13.24 71.12,13.24 | 71.12,13.24 81.28,13.24 | 81.28,13.24 86.36,13.24 | 86.36,13.24 96.52,13.24 | 96.52,13.24 101.6,13.24 | 101.6,13.24 111.76,13.24 | 111.76,13.24 116.84,13.24 | 116.84,13.24 127,13.24 T1.A1 121.92,18.32 R1C.2 | 10.16,6.97 10.16,13.24 | 25.4,13.24 25.4,6.97 | 20.32,13.24 T8.A1 15.24,18.32 R8C.2 | 35.56,13.24 T7.A1 30.48,18.32 R7C.2 | 50.8,13.24 T6.A1 45.72,18.32 R6C.2 | 40.64,13.24 40.64,6.97 | 55.88,13.24 55.88,6.97 | 71.12,13.24 71.12,6.97 | 86.36,13.24 86.36,6.97 | 101.6,13.24 101.6,6.97 | 116.84,13.24 116.84,6.97 | 66.04,13.24 T5.A1 60.96,18.32 R5C.2 | 81.28,13.24 T4.A1 76.2,18.32 R4C.2 | 96.52,13.24 T3.A1 91.44,18.32 R3C.2 | 111.76,13.24 T2.A1 106.68,18.32 R2C.2
PHASE
  Bottom 1.27: T8.A2 12.7,20.86 R8B.2
  Bottom 1.5: 19.05,8.16 12.7,14.51 R8B.2
SYNC
  Top 0.61: R30.1 15.24,56.42 48.26,56.42 48.26,71.66 63.5,71.66 66.04,70.39 95.25,70.39 95.25,80.55 101.6,80.55 102.87,81.82 I4.3
  Bottom 0.61: I4.3 I3.3 | R31.2 R30.1
VCC
  Bottom 0.61: JP1.2 C4.2 REG_3.3V.IN 52.07,85.63 59.69,85.63 59.69,83.09 55.88,83.09 53.34,80.55 48.26,80.55 48.26,74.2 | 45.72,50.07 46.99,48.8 52.07,48.8 53.34,50.07 53.34,74.2 | 48.26,74.2 29.21,74.2 IC3.20 24.13,72.93 22.86,71.66 19.05,71.66 17.78,70.39 17.78,62.77 R26.2 R30.2 | 48.26,74.2 53.34,74.2 | 53.34,74.2 58.42,74.2 IC1.20 R25.2 R28.1
VDD
  Top 0.61: U1.VDD 119.38,58.96 119.38,67.85 115.57,67.85 U1.SPISWP 115.57,74.2 102.87,74.2 101.6,72.93 101.6,58.96 R32.2
  Bottom 0.61: R32.2 92.71,58.96 90.17,61.5 88.9,61.5 80.01,70.39 74.93,70.39 74.93,74.2 73.66,75.47 67.31,75.47 67.31,80.55 66.04,81.82 C5.1 57.15,79.28 | REG_3.3V.OUT 57.15,79.28 | +3.3V.1 57.15,79.28

### Text on the board
tPlace: Synchro | 12v~ | BARREAU Pascal | Jennic-Lumiere